# EasyEDA schematic SCH_esp32_with_RTC_and_SD_card_2024-11-03.json
TITLE: ESP32_WITH_RTC_AND_SD_CARD_NODULE; REV: 1.0; Date: 2024-07-07; Sheet: 1/1; Drawn By: janardhanbv; Company: Your Company
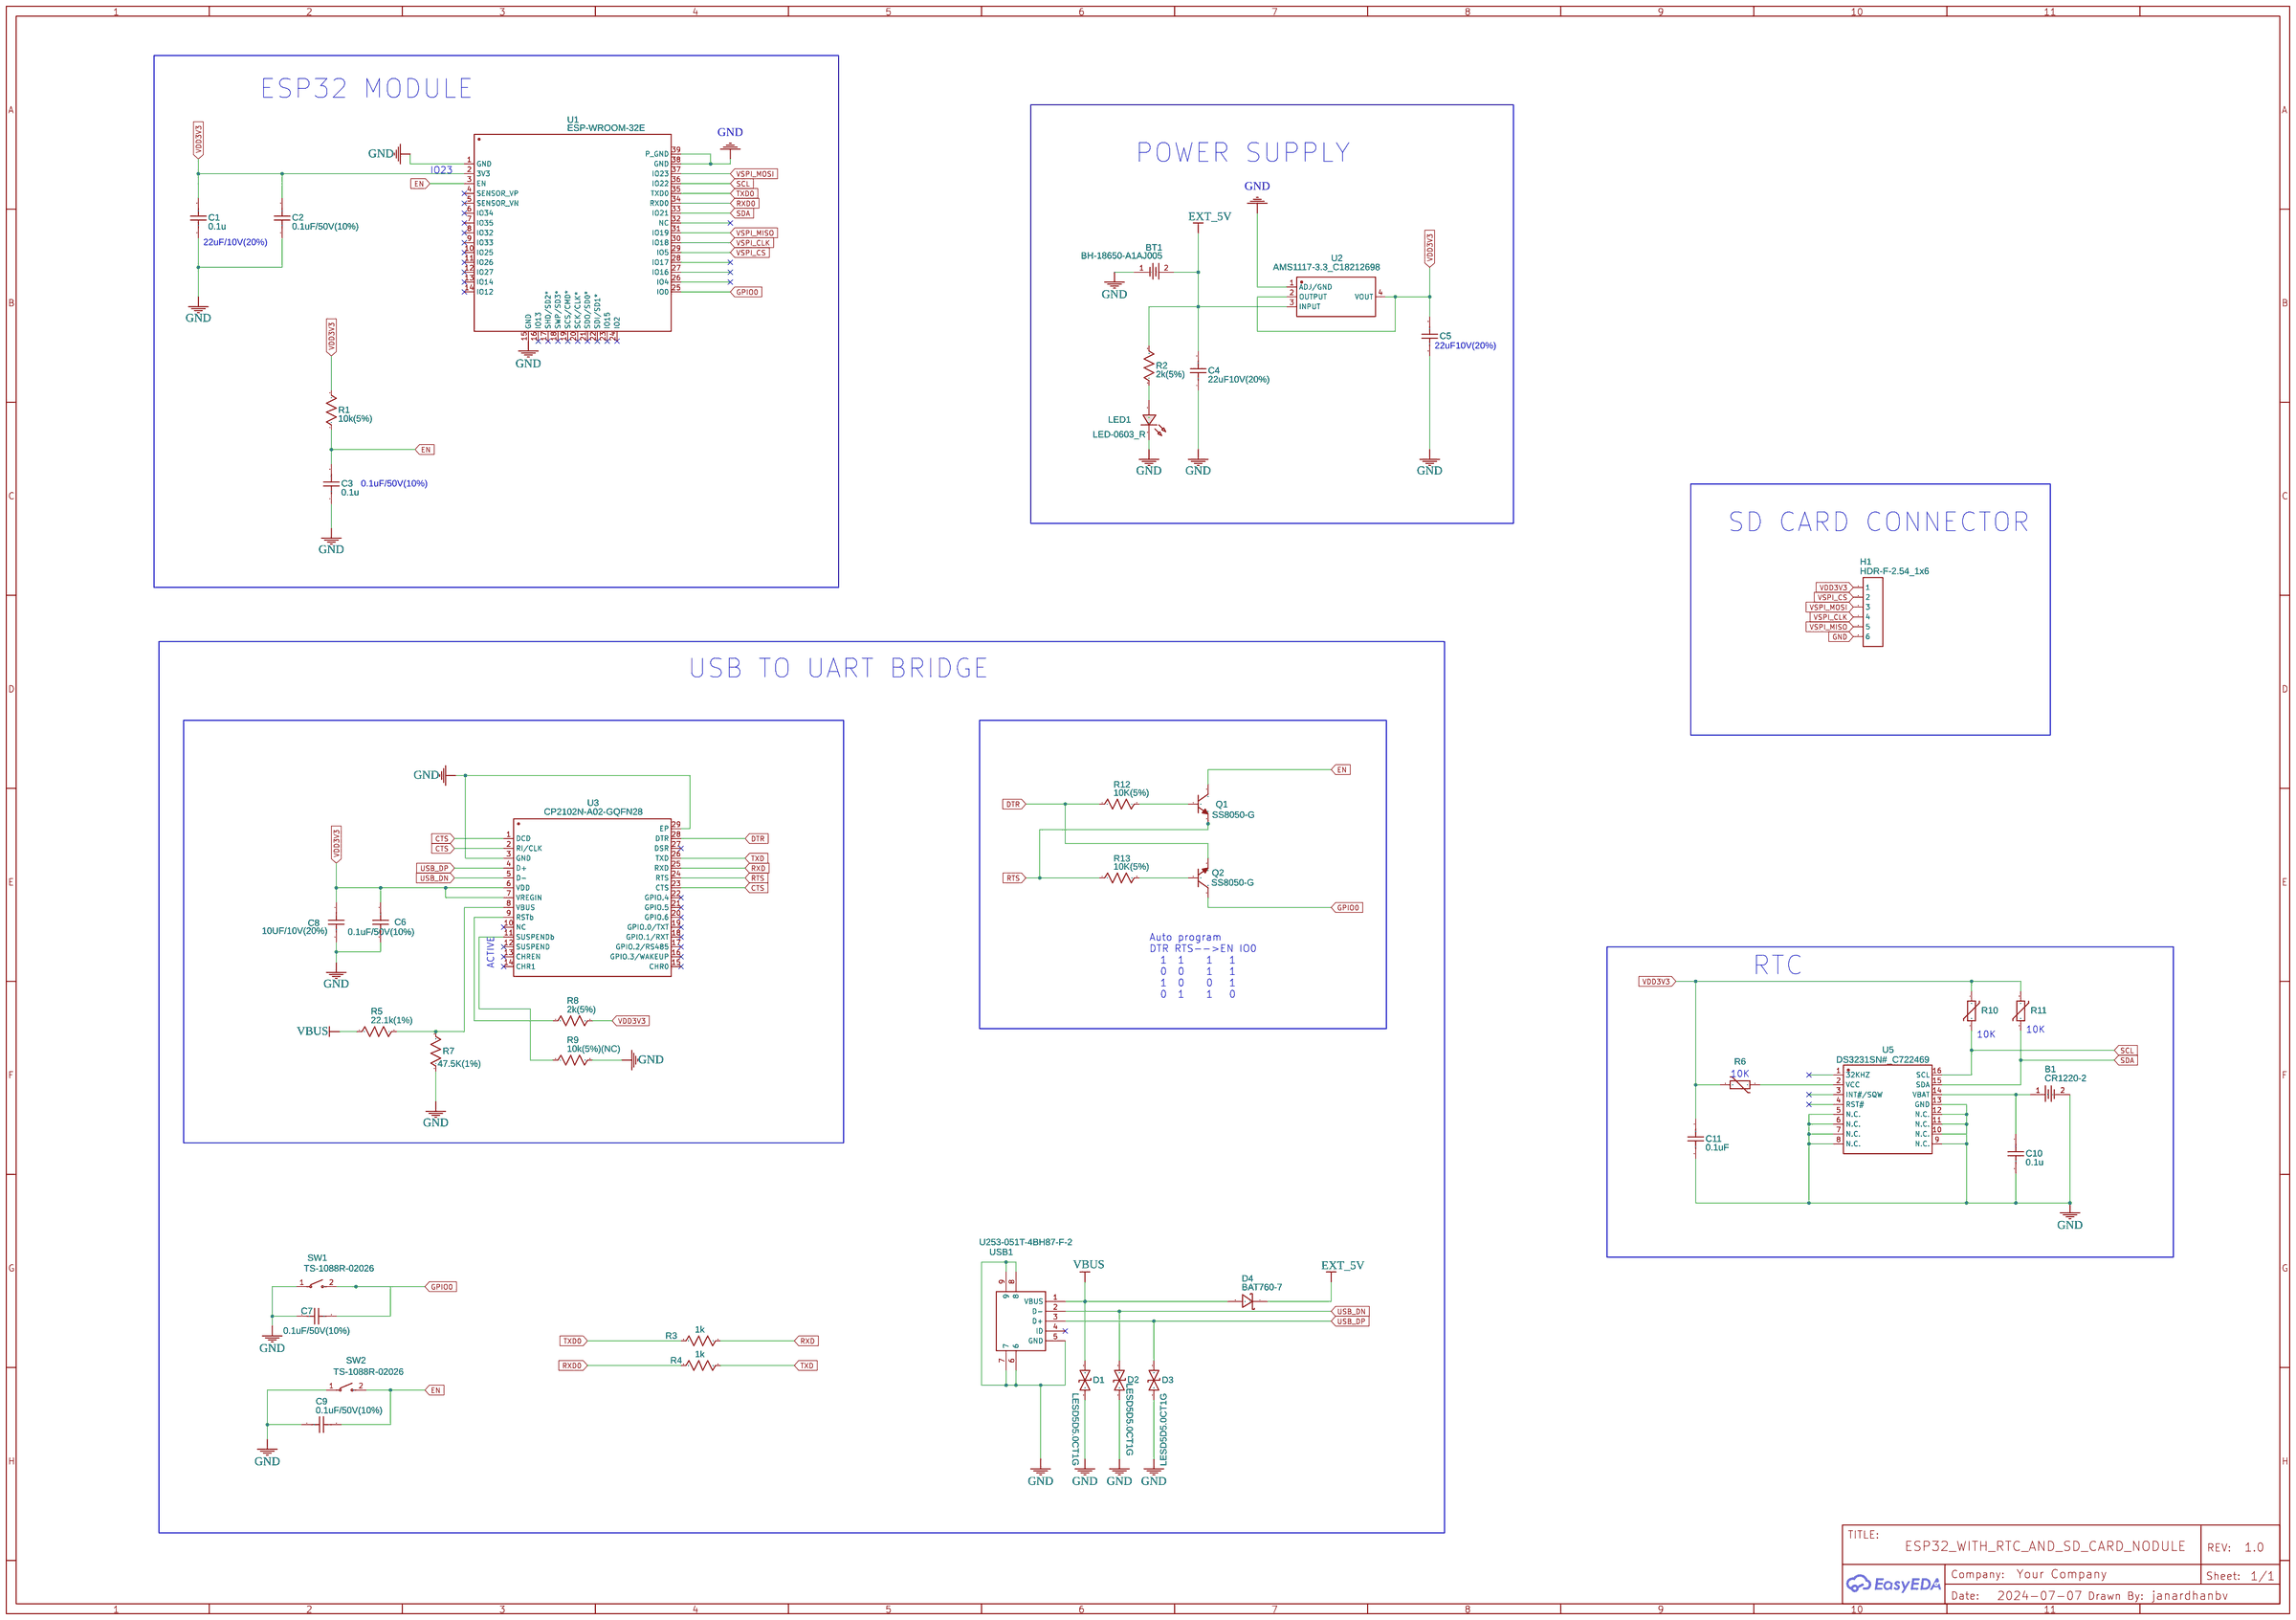
[diagram p0: schematic sheet]

## Parts
B1  CR1220-2  [BAT-SMD_CR1220-2]
BT1  BH-18650-A1AJ005  [BAT-TH_BH-18650-A1AJ005]
C1  0.1u  [C0603]
C2  0.1uF/50V(10%)  [C0603]
C3  0.1u  [C0603]
C4  22uF10V(20%)  [C0603]
C5  0.1u  [C0603]
C6  0.1uF/50V(10%)  [C0603]
C7  0.1uF/50V(10%)  [C0603]
C8  10UF/10V(20%)  [C0603]
C9  0.1uF/50V(10%)  [C0603]
C10  0.1u  [C0603]
C11  0.1uF  [C0603]
D1  LESD5D5.0CT1G  [SOD-523_L1.2-W0.8-LS1.6-BI]
D2  LESD5D5.0CT1G  [SOD-523_L1.2-W0.8-LS1.6-BI]
D3  LESD5D5.0CT1G  [SOD-523_L1.2-W0.8-LS1.6-BI]
D4  BAT760-7  [SOD-323_L1.8-W1.3-LS2.5-RD]
H1  HDR-F-2.54_1x6  [HDR-F-2.54_1X6]
LED1  LED-0603_R  [LED0603_RED]
Q1  SS8050-G  [SOT-23-3_L2.9-W1.3-P1.90-LS2.4-BR]
Q2  SS8050-G  [SOT-23-3_L2.9-W1.3-P1.90-LS2.4-BR]
R1  10k(5%)  [R0603]
R2  2k(5%)  [R0603]
R3  1k  [R0603]
R4  1k  [R0603]
R5  22.1k(1%)  [R0603]
R6  VARISTOR-5  [R-5]
R7  47.5K(1%)  [R0603]
R8  2k(5%)  [R0603]
R9  10k(5%)(NC)  [R0603]
R10  VARISTOR-5  [R-5]
R11  VARISTOR-5  [R-5]
R12  10K(5%)  [R0603]
R13  10K(5%)  [R0603]
SW1  TS-1088R-02026  [SW-SMD_L3.9-W3.0-P4.45]
SW2  TS-1088R-02026  [SW-SMD_L3.9-W3.0-P4.45]
U1  ESP-WROOM-32E  [COMM-SMD_ESP-WROOM-32D]
U2  AMS1117-3.3_C18212698  [SOT-223-3_L6.5-W3.4-P2.30-LS7.0-BR]
U3  CP2102N-A02-GQFN28  [QFN-28_L5.0-W5.0-P0.50-TL-EP3.3]
U5  DS3231SN#_C722469  [SOIC-16_L10.3-W7.5-P1.27-LS10.3-BL]
USB1  U253-051T-4BH87-F-2  [MICRO-USB-SMD_U253-051T-4BH87-S-2]

## Library data of the parts
B1 = CR1220-2: Supplier: LCSC; Manufacturer: Q&J; Supplier Part: C70381; JLCPCB Part Class: Extended Part
BT1 = BH-18650-A1AJ005: Supplier: LCSC; Supplier Part: C5290176; Manufacturer: MYOUNG(美阳); JLCPCB Part Class: Extended Part; Contributor: lcsc
C1-C11 = C_0603_US: Contributor: LCEDA_Lib
D1-D3 = LESD5D5.0CT1G: Contributor: LCSC; Supplier: LCSC; Supplier Part: C383211; Manufacturer: LRC(乐山无线电); JLCPCB Part Class: Extended Part
D4 = BAT760-7: Contributor: LCSC; Supplier: LCSC; Manufacturer: DIODES(美台); Supplier Part: C124187; JLCPCB Part Class: Extended Part
H1 = HDR-F-2.54_1x6: Supplier Part: C40877; Supplier: LCSC; Contributor: LCEDA_Lib
LED1 = LED-0603_R: Manufacturer: EVERLIGHT(台湾亿光); Manufacturer Part: 19-217/R6C-AL1M2VY/3T; Supplier Part: C72044; Supplier: LCSC; Contributor: LCEDA_01
Q1 Q2 = SS8050-G: Contributor: LCSC; Supplier: LCSC; Manufacturer: CJ(江苏长电/长晶); Supplier Part: C164886; JLCPCB Part Class: Extended Part
R1-R5 R7-R9 R12 R13 = R_0603_US: Contributor: LCEDA_Lib
R6 R10 R11 = VARISTOR-5: VARISTOR; Contributor: Pinoccio
SW1 SW2 = TS-1088R-02026: Contributor: LCSC; Supplier: LCSC; Supplier Part: C455280; Manufacturer: XUNPU(讯普); JLCPCB Part Class: Extended Part
U1 = ESP-WROOM-32E: Supplier: LCSC; Supplier Part: C19949066; Manufacturer: DOIT(四博智联); Contributor: lcsc; JLCPCB Part Class: Extended Part
U2 = AMS1117-3.3_C18212698: Supplier: LCSC; Supplier Part: C18212698; Manufacturer: TECH PUBLIC(台舟); Manufacturer Part: AMS1117-3.3; Contributor: lcsc
U3 = CP2102N-A02-GQFN28: Contributor: LCSC; Supplier: LCSC; Supplier Part: C1550553; Manufacturer: SKYWORKS/SILICON LABS(芯科); JLCPCB Part Class: Extended Part
U5 = DS3231SN#_C722469: Contributor: lcsc; Supplier: LCSC; Supplier Part: C722469; Manufacturer: ADI(亚德诺)/MAXIM(美信); Manufacturer Part: DS3231SN#; JLCPCB Part Class: Extended Part
USB1 = U253-051T-4BH87-F-2: Contributor: LCSC; Supplier: LCSC; Supplier Part: C319174; Manufacturer: XKB Connectivity(中国星坤); Manufacturer Part: U253-051T-4BH87-S2; JLCPCB Part Class: Extended Part

## Nets
GND: B1.2 BT1.1 C1.1 C2.1 C3.1 C4.1 C5.1 C6.2 C7.1 C8.2 C9.1 C10.2 C11.1 D1.1 D2.1 D3.1 H1.6 LED1.2 R7.1 R9.2 SW1.1 SW2.1 U1.1(GND) U1.15(GND) U1.38(GND) U1.39(P_GND) U2.1(ADJ/GND) U3.3(GND) U3.29(EP) U5.5(N.C.) U5.6(N.C.) U5.7(N.C.) U5.8(N.C.) U5.9(N.C.) U5.10(N.C.) U5.11(N.C.) U5.12(N.C.) U5.13(GND) USB1.5(GND) USB1.6 USB1.7 USB1.8 USB1.9
VBUS: D1.2 D4.2 R5.1 USB1.1(VBUS)
VDD3V3: C1.2 C2.2 C5.2 C6.1 C8.1 C11.2 H1.1 R1.2 R6.2 R8.2 R10.1 R11.1 U1.2(3V3) U2.2(OUTPUT) U2.4(VOUT) U3.6(VDD) U3.7(VREGIN)
CTS: U3.1(DCD) U3.2(RI/CLK) U3.23(CTS)
DTR: Q2.2(E) R12.1 U3.28(DTR)
EN: C3.2 C9.2 Q1.3(C) R1.1 SW2.2 U1.3(EN)
EXT_5V: BT1.2 C4.2 D4.1 R2.2 U2.3(INPUT)
GPIO0: C7.2 Q2.3(C) SW1.2 U1.25(IO0)
RTS: Q1.2(E) R13.1 U3.24(RTS)
RXD: R3.2 U3.25(RXD)
RXD0: R4.1 U1.34(RXD0)
SCL: R10.2 U1.36(IO22) U5.16(SCL)
SDA: R11.2 U1.33(IO21) U5.15(SDA)
TXD: R4.2 U3.26(TXD)
TXD0: R3.1 U1.35(TXD0)
USB_DN: D2.2 U3.5(D-) USB1.2(D-)
USB_DP: D3.2 U3.4(D+) USB1.3(D+)
VSPI_CLK: H1.4 U1.30(IO18)
VSPI_CS: H1.2 U1.29(IO5)
VSPI_MISO: H1.5 U1.31(IO19)
VSPI_MOSI: H1.3 U1.37(IO23)
Net-(B1-1): B1.1 C10.1 U5.14(VBAT)
Net-(LED1-1): LED1.1 R2.1
Net-(Q1-1): Q1.1(B) R12.2
Net-(Q2-1): Q2.1(B) R13.2
Net-(R5-2): R5.2 R7.2 U3.8(VBUS)
Net-(R6-1): R6.1 U5.2(VCC)
Net-(R8-1): R8.1 U3.9(RSTb)
Net-(R9-1): R9.1 U3.11(SUSPENDb)

Not connected (* = marked no-connect by the designer): U1 4(SENSOR_VP)* 5(SENSOR_VN)* 6(IO34)* 7(IO35)* 8(IO32)* 9(IO33)* 10(IO25)* 11(IO26)* 12(IO27)* 13(IO14)* 14(IO12)* 16(IO13)* 17(SHD/SD2*)* 18(SWP/SD3*)* 19(SCS/CMD*)* 20(SCK/CLK*)* 21(SDO/SD0*)* 22(SDI/SD1*)* 23(IO15)* 24(IO2)* 26(IO4) 27(IO16) 28(IO17) 32(NC); U3 10(NC)* 12(SUSPEND)* 13(CHREN)* 14(CHR1)* 15(CHR0)* 16(GPIO.3/WAKEUP)* 17(GPIO.2/RS485)* 18(GPIO.1/RXT)* 19(GPIO.0/TXT)* 20(GPIO.6)* 21(GPIO.5)* 22(GPIO.4)* 27(DSR)*; U5 1(32KHZ) 3(INT#/SQW) 4(RST#); USB1 4(ID)*

## Notes on the sheet
- ESP32 MODULE
- POWER SUPPLY
- IO23
- 22uF/10V(20%)
- 22uF10V(20%)
- 0.1uF/50V(10%)
- SD CARD CONNECTOR
- USB TO UART BRIDGE
- Auto program
  DTR RTS-->EN IO0
    1  1    1   1
    0  0    1   1
    1  0    0   1
    0  1    1   0
- RTC
- ACTIVE
- 10K
- 10K
- 10K
